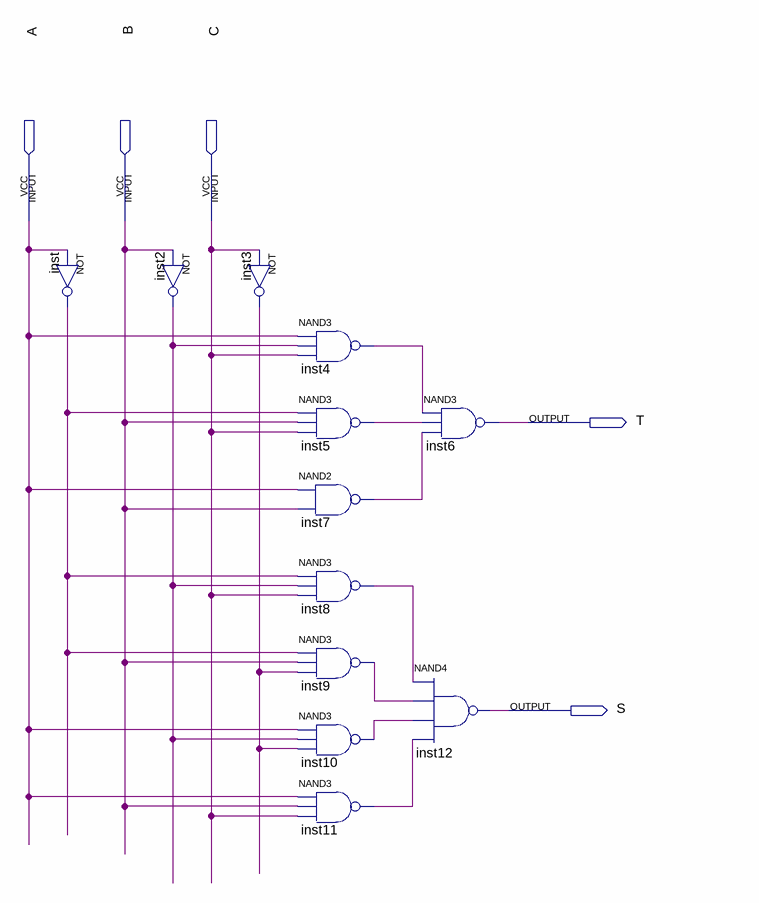
[diagram p0: schematic sheet]
// Quartus schematic 2-2.bdf as structural Verilog: 12 symbols, 5 pins
module \2-2  (
  input  A,
  input  B,
  input  C,
  output T,
  output S
);

  wire inst2_out, inst3_out, inst4_out, inst5_out, inst7_out, inst8_out, inst9_out, inst10_out, inst11_out,
       inst_out;

  not inst (inst_out, A);
  not inst2 (inst2_out, B);
  not inst3 (inst3_out, C);
  nand inst4 (inst4_out, A, inst2_out, C);
  nand inst5 (inst5_out, inst_out, B, C);
  nand inst7 (inst7_out, A, B);
  nand inst8 (inst8_out, inst_out, inst2_out, C);
  nand inst9 (inst9_out, inst_out, B, inst3_out);
  nand inst10 (inst10_out, A, inst2_out, inst3_out);
  nand inst11 (inst11_out, A, B, C);
  nand inst6 (T, inst4_out, inst5_out, inst7_out);
  nand inst12 (S, inst8_out, inst9_out, inst10_out, inst11_out);
endmodule
